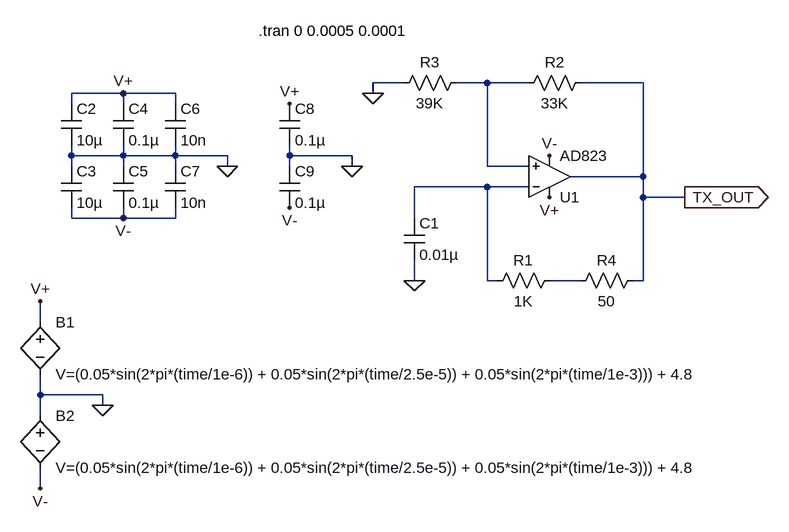
[diagram p0: schematic Transmitter_AD823_noisy.asc]
Transmitter_AD823_noisy.asc, the LTspice schematic file:
Version 4
SHEET 1 880 888
WIRE 32 48 -16 48
WIRE 160 48 112 48
WIRE 224 48 160 48
WIRE 400 48 304 48
WIRE -400 64 -480 64
WIRE -320 64 -400 64
WIRE -16 64 -16 48
WIRE -480 80 -480 64
WIRE -400 80 -400 64
WIRE -320 80 -320 64
WIRE -480 160 -480 144
WIRE -400 160 -400 144
WIRE -400 160 -480 160
WIRE -320 160 -320 144
WIRE -320 160 -400 160
WIRE -240 160 -320 160
WIRE -144 160 -144 144
WIRE -48 160 -144 160
WIRE -480 176 -480 160
WIRE -400 176 -400 160
WIRE -320 176 -320 160
WIRE -240 176 -240 160
WIRE -144 176 -144 160
WIRE -48 176 -48 160
WIRE 160 176 160 48
WIRE 224 176 160 176
WIRE 400 192 400 48
WIRE 400 192 288 192
WIRE 160 208 48 208
WIRE 224 208 160 208
WIRE 400 224 400 192
WIRE 464 224 400 224
WIRE -480 256 -480 240
WIRE -400 256 -400 240
WIRE -400 256 -480 256
WIRE -320 256 -320 240
WIRE -320 256 -400 256
WIRE 48 256 48 208
WIRE 48 352 48 320
WIRE 160 352 160 208
WIRE 176 352 160 352
WIRE 304 352 256 352
WIRE 400 352 400 224
WIRE 400 352 384 352
WIRE -528 416 -528 384
WIRE -528 528 -528 496
WIRE -432 528 -528 528
WIRE -432 544 -432 528
WIRE -528 560 -528 528
WIRE -528 672 -528 640
FLAG 48 352 0
FLAG -16 64 0
FLAG -432 544 0
FLAG -528 384 V+
FLAG 256 224 V+
FLAG -528 672 V-
FLAG 256 160 V-
FLAG 464 224 TX_OUT
IOPIN 464 224 Out
FLAG -400 256 V-
FLAG -400 64 V+
FLAG -240 176 0
FLAG -144 240 V-
FLAG -144 80 V+
FLAG -48 176 0
SYMBOL cap 32 256 R0
SYMATTR InstName C1
SYMATTR Value 0.01µ
SYMATTR SpiceLine V=10 Irms=0 Rser=0.01 Lser=0
SYMBOL res 272 336 R90
WINDOW 0 0 56 VBottom 2
WINDOW 3 32 56 VTop 2
SYMATTR InstName R1
SYMATTR Value 1K
SYMATTR SpiceLine tol=1 pwr=0.1
SYMBOL res 320 32 R90
WINDOW 0 0 56 VBottom 2
WINDOW 3 32 56 VTop 2
SYMATTR InstName R2
SYMATTR Value 33K
SYMBOL res 128 32 R90
WINDOW 0 0 56 VBottom 2
WINDOW 3 32 56 VTop 2
SYMATTR InstName R3
SYMATTR Value 39K
SYMBOL res 400 336 R90
WINDOW 0 0 56 VBottom 2
WINDOW 3 32 56 VTop 2
SYMATTR InstName R4
SYMATTR Value 50
SYMBOL Opamps\\AD823 256 256 M180
SYMATTR InstName U1
SYMBOL cap -496 80 R0
SYMATTR InstName C2
SYMATTR Value 10µ
SYMATTR SpiceLine Rser=0.1
SYMBOL cap -496 176 R0
SYMATTR InstName C3
SYMATTR Value 10µ
SYMATTR SpiceLine Rser=0.1
SYMBOL cap -416 80 R0
SYMATTR InstName C4
SYMATTR Value 0.1µ
SYMATTR SpiceLine Rser=0.1
SYMBOL cap -416 176 R0
SYMATTR InstName C5
SYMATTR Value 0.1µ
SYMATTR SpiceLine Rser=0.1
SYMBOL cap -336 80 R0
SYMATTR InstName C6
SYMATTR Value 10n
SYMATTR SpiceLine Rser=0.1
SYMBOL cap -336 176 R0
SYMATTR InstName C7
SYMATTR Value 10n
SYMATTR SpiceLine Rser=0.1
SYMBOL cap -160 80 R0
SYMATTR InstName C8
SYMATTR Value 0.1µ
SYMBOL cap -160 176 R0
SYMATTR InstName C9
SYMATTR Value 0.1µ
SYMBOL bv -528 400 R0
SYMATTR InstName B1
SYMATTR Value V=(0.05*sin(2*pi*(time/1e-6)) + 0.05*sin(2*pi*(time/2.5e-5)) + 0.05*sin(2*pi*(time/1e-3))) + 4.8
SYMBOL bv -528 544 R0
SYMATTR InstName B2
SYMATTR Value V=(0.05*sin(2*pi*(time/1e-6)) + 0.05*sin(2*pi*(time/2.5e-5)) + 0.05*sin(2*pi*(time/1e-3))) + 4.8
TEXT -192 -32 Left 2 !.tran 0 0.0005 0.0001

The netlist it stands for:
* Transmitter_AD823_noisy.asc
C1 N002 0 0.01µ V=10 Irms=0 Rser=0.01 Lser=0
R1 N003 N002 1K tol=1 pwr=0.1
R2 TX_OUT N001 33K
R3 N001 0 39K
R4 TX_OUT N003 50
XU1 N001 N002 V+ V- TX_OUT AD823  ; pins In+ In- V+ V- OUT
C2 V+ 0 10µ Rser=0.1
C3 0 V- 10µ Rser=0.1
C4 V+ 0 0.1µ Rser=0.1
C5 0 V- 0.1µ Rser=0.1
C6 V+ 0 10n Rser=0.1
C7 0 V- 10n Rser=0.1
C8 V+ 0 0.1µ
C9 0 V- 0.1µ
B1 V+ 0 V=(0.05*sin(2*pi*(time/1e-6)) + 0.05*sin(2*pi*(time/2.5e-5)) + 0.05*sin(2*pi*(time/1e-3))) + 4.8
B2 0 V- V=(0.05*sin(2*pi*(time/1e-6)) + 0.05*sin(2*pi*(time/2.5e-5)) + 0.05*sin(2*pi*(time/1e-3))) + 4.8
.tran 0 0.0005 0.0001
.lib ADI.lib
.backanno
.end